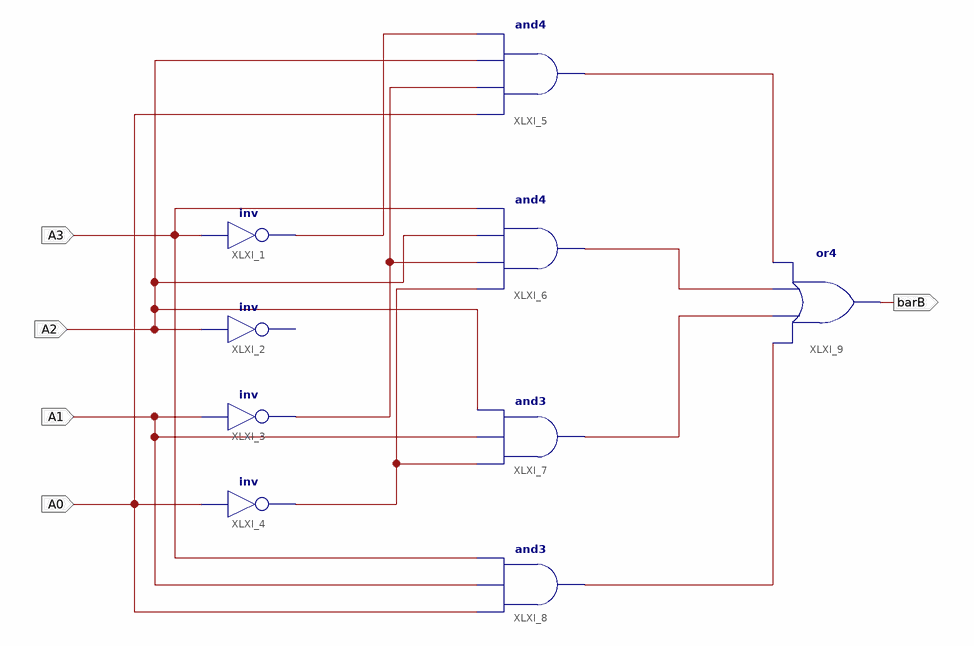
[diagram p0: schematic sheet 1]
// Xilinx ISE schematic fnd2.sch (spartan6) as structural Verilog: 9 symbols, 5 ports
module fnd2 (
  input  A3,
  input  A1,
  input  A0,
  input  A2,
  output barB
);

  wire XLXN_9, XLXN_12, XLXN_18, XLXN_23, XLXN_24, XLXN_25, XLXN_26;

  not XLXI_1 (XLXN_9, A3);
  // inv XLXI_2 has open pins: I=A2, O=open
  not XLXI_3 (XLXN_12, A1);
  not XLXI_4 (XLXN_18, A0);
  and XLXI_5 (XLXN_23, A0, XLXN_12, A2, XLXN_9);
  and XLXI_6 (XLXN_24, XLXN_18, XLXN_12, A2, A3);
  and XLXI_7 (XLXN_25, XLXN_18, A1, A2);
  and XLXI_8 (XLXN_26, A0, A1, A3);
  or XLXI_9 (barB, XLXN_26, XLXN_25, XLXN_24, XLXN_23);
endmodule
